# EAGLE design IR (EAGLE 9.6.2)
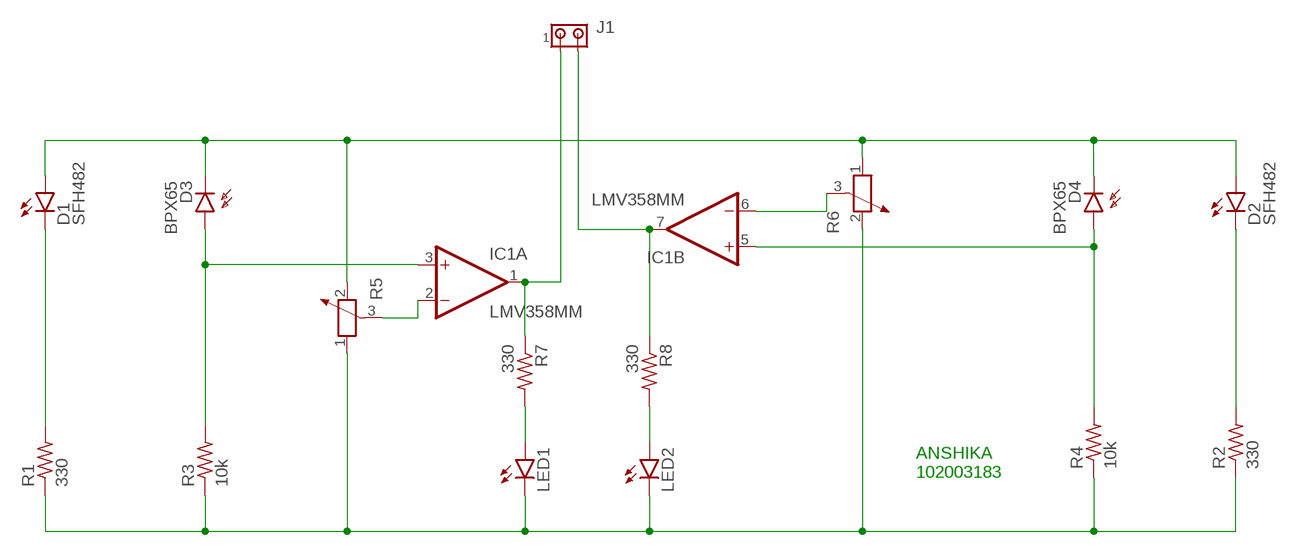
[diagram p0: schematic, sheet 1]

## Parts
D1  SFH482  [SFH482]
D2  SFH482  [SFH482]
D3  BPX65  [BPX65]
D4  BPX65  [BPX65]
IC1  LMV358MM  [MSOP08]
J1  MTA02-100  [10X02MTA]
LED1  LED3MM  [LED3MM]
LED2  LED3MM  [LED3MM]
R1  330  R-US_0207/10  [0207/10]
R2  330  R-US_0207/10  [0207/10]
R3  10k  R-US_0207/10  [0207/10]
R4  10k  R-US_0207/10  [0207/10]
R5  POTENTIOMETER_PT-10S  [PT-10S]
R6  POTENTIOMETER_PT-10S  [PT-10S]
R7  330  R-US_0207/10  [0207/10]
R8  330  R-US_0207/10  [0207/10]

## Nets
N$1: D1.K(C) R1.2
N$2: D3.A IC1.3(A:+IN) R3.2
N$3: D1.A D2.A D3.K(C) D4.K(C) R5.2 R6.1
N$4: D4.A IC1.5(B:+IN) R4.2
N$5: D2.K(C) R2.2
N$6: LED1.K(C) LED2.K(C) R1.1 R2.1 R3.1 R4.1 R5.1 R6.2
N$7: IC1.2(A:-IN) R5.3
N$8: LED2.A R8.2
N$9: LED1.A R7.2
N$10: IC1.1(A:OUT) J1.1 R7.1
N$11: IC1.7(B:OUT) J1.2 R8.1
N$12: IC1.6(B:-IN) R6.3

## Notes on the sheet
- ANSHIKA
  102003183

## Power pins joined to a net without a drawn wire
V+: IC1.8(P:V+)
V-: IC1.4(P:V-)

## Library data of the parts
D1 D2 = led:SFH482: IR LED infrared emitting diode, Infineon
D3 D4 = opto-trans-siemens:BPX65: PHOTO DIODE; MPN: BPX65.; OC_FARNELL: 327451; OC_NEWARK: 06WX2764
IC1 = linear:LMV358?*: Dual General Purpose, Low Voltage, Rail-to-Rail Output Operational Amplifiers Source: http://www.national.com/mpf/LM/LMV321.html http://www.national.com/dt/lmv_qual.pdf
J1 = con-amp:MTA02-100: AMP connector
LED1 LED2 = led:LED: LED OSRAM: - CHIPLED LG R971, LG N971, LY N971, LG Q971, LY Q971, LO R971, LY R971 LH N974, LH R974 LS Q976, LO Q976, LY Q976 LO Q996 - Hyper CHIPLED LW Q18S LB Q993, LB Q99A, LB R99A - SideLED LS A670, LO A670, LY A670, LG A670, LP A670 LB A673, LV A673, LT A673, LW A673 LH A674 LY A675 LS A676, LA A676, LO A676, LY A676, LW A676 LS A679, LY A679, LG A679 - Hyper Micro SIDELED® LS Y876, LA Y876, LO Y876, LY Y876 LT Y87S - SmartLED LW L88C, LW L88S LB L89C, LB L89S, LG L890 LS L89K, LO L89K, LY L89K LS L896, LA L896, LO L896, LY L896 - TOPLED LS T670, LO T670, LY T670, LG T670, LP T670 LSG T670, LSP T670, LSY T670, LOP T670, LYG T670 LG T671, LOG T671, LSG T671 LB T673, LV T673, LT T673, LW T673 LH T674 LS T676, LA T676, LO T676, LY T676, LB T676, LH T676, LSB T676, LW T676 LB T67C, LV T67C, LT T67C, LS T67K, LO T67K, LY T67K, LW E67C LS E67B, LA E67B, LO E67B, LY E67B, LB E67C, LV E67C, LT E67C LW T67C LS T679, LY T679, LG T679 LS T770, LO T770, LY T770, LG T770, LP T770 LB T773, LV T773, LT T773, LW T773 LH T774 LS E675, LA E675, LY E675, LS T675 LS T776, LA T776, LO T776, LY T776, LB T776 LHGB T686 LT T68C, LB T68C - Hyper Mini TOPLED® LB M676 - Mini TOPLED Santana® LG M470 LS M47K, LO M47K, LY M47K Source: http://www.osram.convergy.de LUXEON: - LUMILED® LXK2-PW12-R00, LXK2-PW12-S00, LXK2-PW14-U00, LXK2-PW14-V00 LXK2-PM12-R00, LXK2-PM12-S00, LXK2-PM14-U00 LXK2-PE12-Q00, LXK2-PE12-R00, LXK2-PE12-S00, LXK2-PE14-T00, LXK2-PE14-U00 LXK2-PB12-K00, LXK2-PB12-L00, LXK2-PB12-M00, LXK2-PB14-N00, LXK2-PB14-P00, LXK2-PB14-Q00 LXK2-PR12-L00, LXK2-PR12-M00, LXK2-PR14-Q00, LXK2-PR14-R00 LXK2-PD12-Q00, LXK2-PD12-R00, LXK2-PD12-S00 LXK2-PH12-R00, LXK2-PH12-S00 LXK2-PL12-P00, LXK2-PL12-Q00, LXK2-PL12-R00 Source: www.luxeon.com KINGBRIGHT: KA-3528ASYC Source: www.kingbright.com
R1-R4 R7 R8 = rcl:R-US_: RESISTOR, American symbol; SPICEPREFIX: R
R5 R6 = rcl:POTENTIOMETER_: Potentiometer; SPICEMODEL: POT; SPICEPREFIX: X

## Board
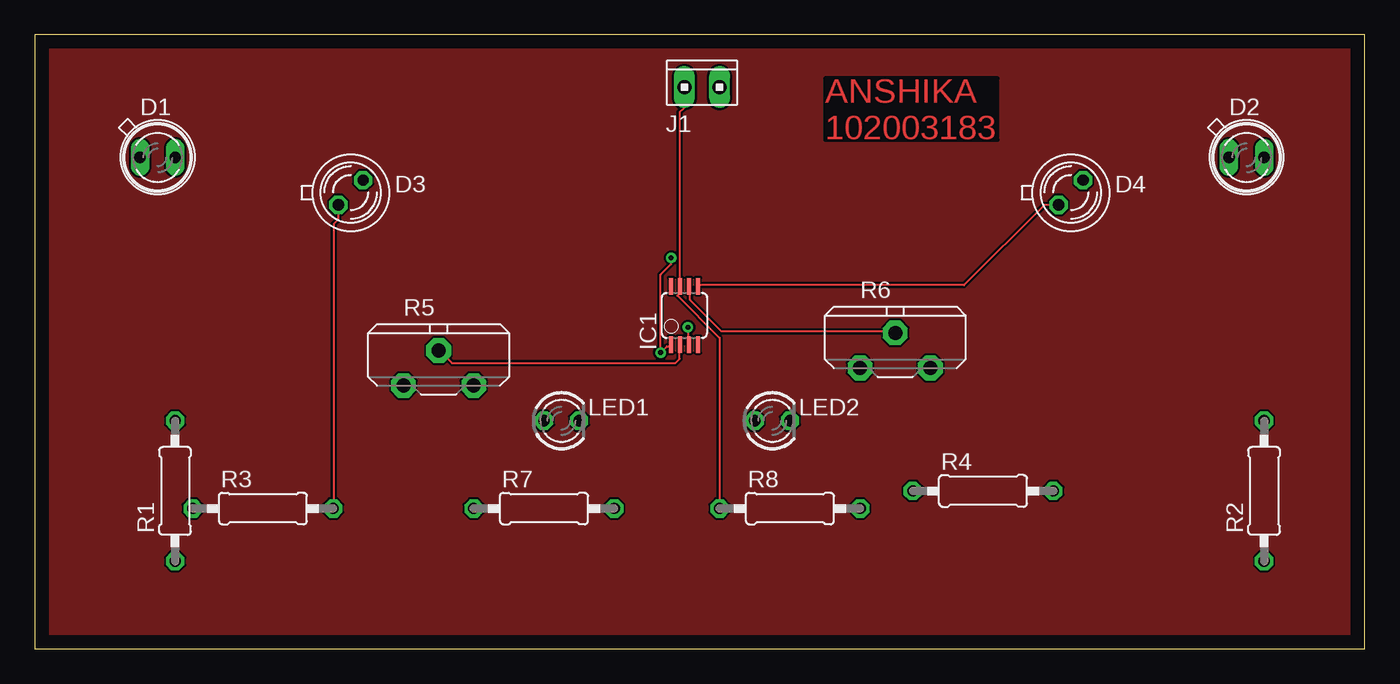
[diagram p1: board, top side]
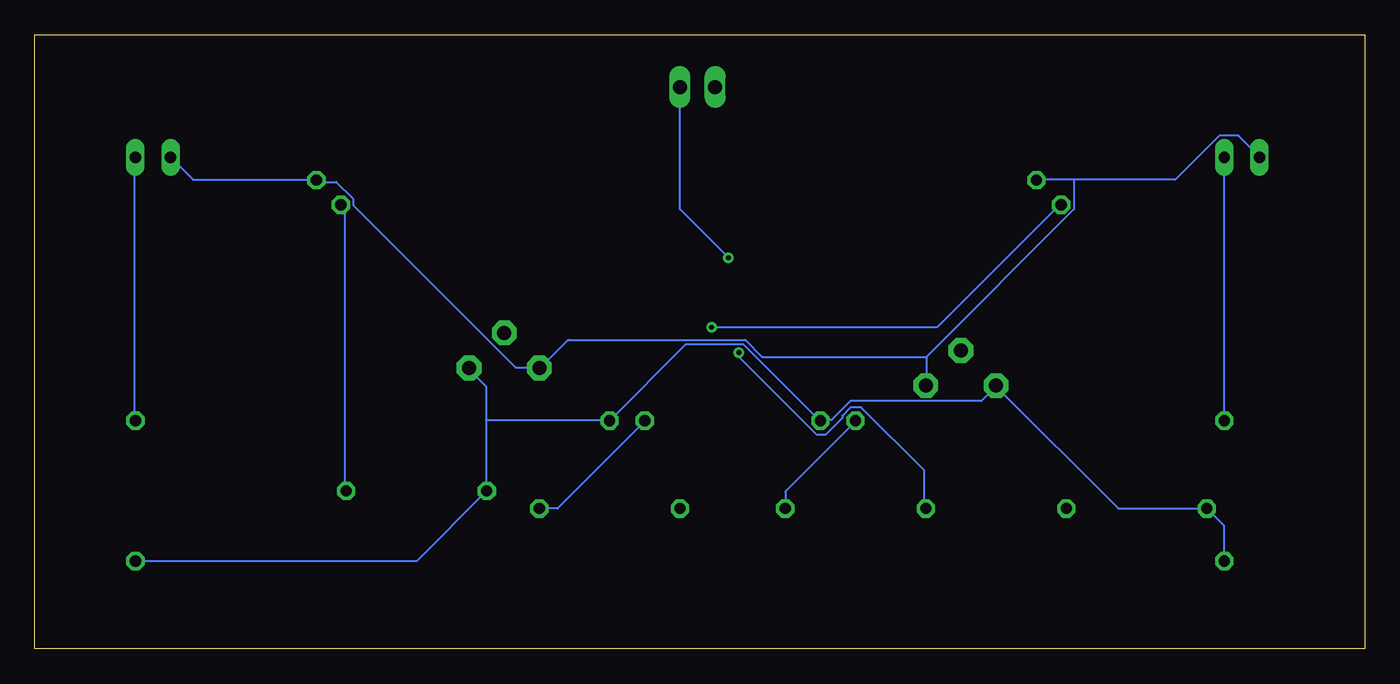
[diagram p2: board, bottom side, seen from below]

Size 96.19 x 44.44 mm. Coordinates in mm from the lower left corner, seen from the top.
Outline: 0,0 96.19,0 96.19,44.44 0,44.44 0,0
Copper layers (1*16): Top 0.035mm / dielectric 1.5mm / Bottom 0.035mm
Design rules "default": minimum track width 6mil, minimum drill 0.35mm, track to track 6mil, track to pad 6mil, pad to pad 6mil, via to via 6mil, smd to smd 6mil, copper to edge 40mil, drill to drill 6mil, minimum pad ring 10mil, minimum via ring 8mil, stop-mask expansion 4mil, vias tented up to drill 0mil, thermal gap 10mil

### Footprints (pad centres in the part's own frame; a part is rotated, then mirrored left to right if it is on the bottom)
SFH482 = drill 0.813 long: A -1.27,0; K 1.27,0
BPX65 = drill 0.813 octagon: A -0.889,-0.889; K 0.889,0.889
MSOP08 = smd 0.3 x 1.2: 1 -0.976,-2.113; 2 -0.326,-2.113; 3 0.324,-2.113; 4 0.974,-2.113; 5 0.974,2.112; 6 0.324,2.112; 7 -0.326,2.112; 8 -0.976,2.112
10X02MTA = drill 1.016 long: 1 1.27,0; 2 -1.27,0
LED3MM = drill 0.813 octagon: A -1.27,0; K 1.27,0
0207/10 = drill 0.813 octagon: 1 -5.08,0; 2 5.08,0
PT-10S = drill 1.016 pad 1.778 octagon: 1 -2.54,-1.27; 2 2.54,-1.27; 3 0,1.27

### Placement (x,y rotation side)
D1  8.89,35.56 0 top
D2  87.63,35.56 0 top
D3  22.86,33.02 0 top
D4  74.93,33.02 0 top
IC1  46.99,24.13 0 top
J1  48.26,40.64 0 top
LED1  38.1,16.51 0 top
LED2  53.34,16.51 0 top
R1  10.16,11.43 90 top
R2  88.9,11.43 90 top
R3  16.51,10.16 0 top
R4  68.58,11.43 0 top
R5  29.21,20.32 0 top
R6  62.23,21.59 0 top
R7  36.83,10.16 0 top
R8  54.61,10.16 0 top

### Tracks (layer width: path | path; a pad name or v marks a point on that pad's centre or on a via)
N$1
  Bottom 0.152: R1.2 10.21,16.56 10.21,35.46 D1.K
N$2  (via drill 0.35)
  Top 0.152: v47.24,23.27 47.24,22.05 IC1.3 | R3.2 21.64,10.16 21.64,30.73 21.95,31.04 21.95,32.11 D3.A
  Bottom 0.152: v47.24,23.27 30.94,23.27 22.1,32.11 D3.A
N$3
  Bottom 0.152: 21.03,33.93 13.72,33.93 10.52,37.13 9.14,37.13 7.62,35.61 D1.A | 21.03,33.93 23.62,33.93 D3.K | 31.7,21.13 31.7,19.15 R5.2 | 31.7,21.13 21.03,31.8 21.03,33.93 | D2.A 84.73,33.93 75.89,33.93 D4.K 75.74,33.78 74.37,33.78 73.15,32.56 73.15,32.11 61.42,20.37 59.74,20.37 R6.1 59.59,20.37 57.61,22.35 44.81,22.35 43.59,21.13 31.7,21.13
N$4
  Top 0.152: IC1.5 48.01,26.31 67.21,26.31 73,32.11 73.91,32.11 D4.A
  Bottom 0.152: R4.2 73.76,11.53 73.76,31.95 73.91,32.11 D4.A
N$5
  Bottom 0.152: R2.2 89,16.56 89,35.46 D2.K
N$6
  Bottom 0.152: R1.1 10.21,6.35 10.21,8.94 R3.1 17.83,10.16 26.67,19 | 26.67,19 27.74,17.93 37.19,17.93 38.56,16.56 39.32,16.56 LED1.K 39.47,16.56 44.96,22.05 49.07,22.05 LED2.K 54.71,16.56 63.55,16.56 | 26.67,19 R5.1 | 63.55,16.56 63.55,19 64.77,20.22 R6.2 | 63.55,16.56 63.55,11.53 R4.1 68.58,6.35 R2.1
N$7
  Top 0.152: IC1.2 46.63,21.89 46.63,20.98 46.33,20.68 30.18,20.68 29.26,21.59 R5.3
N$8
  Bottom 0.152: R8.2 58.37,10.16 52.12,16.41 LED2.A
N$9
  Bottom 0.152: R7.2 41.91,11.38 36.88,16.41 LED1.A
N$10  (via drill 0.35)
  Top 0.152: 45.41,21.59 45.72,21.89 45.87,21.89 IC1.1 | v46.02,28.3 46.02,27.84 45.26,27.08 45.26,21.74 45.41,21.59 | 45.41,21.59 v45.26,21.44
  Bottom 0.152: v45.26,21.44 45.26,21.13 39.62,15.49 39.01,15.49 37.8,16.71 37.8,16.87 37.19,17.47 36.42,17.47 31.85,12.9 31.85,10.16 R7.1 | J1.1 49.53,31.8 v46.02,28.3
N$11
  Top 0.152: J1.2 46.94,40.64 46.94,39.12 46.63,38.81 46.63,26.31 IC1.7 46.63,26.16 46.63,25.7 46.48,25.55 49.53,22.5 R8.1
N$12
  Top 0.152: IC1.6 47.4,26.16 47.4,25.25 49.68,22.96 62.18,22.96 R6.3
N$13
  pour Top: 0,44.45 96.52,44.45 96.52,0 0,0

### Text on the board
Top: ANSHIKA / 102003183